# Altium schematic sheet PCB_Slave_Traffic_Light.SchDoc
size A3; SheetNumber: 3; SheetTotal: 3
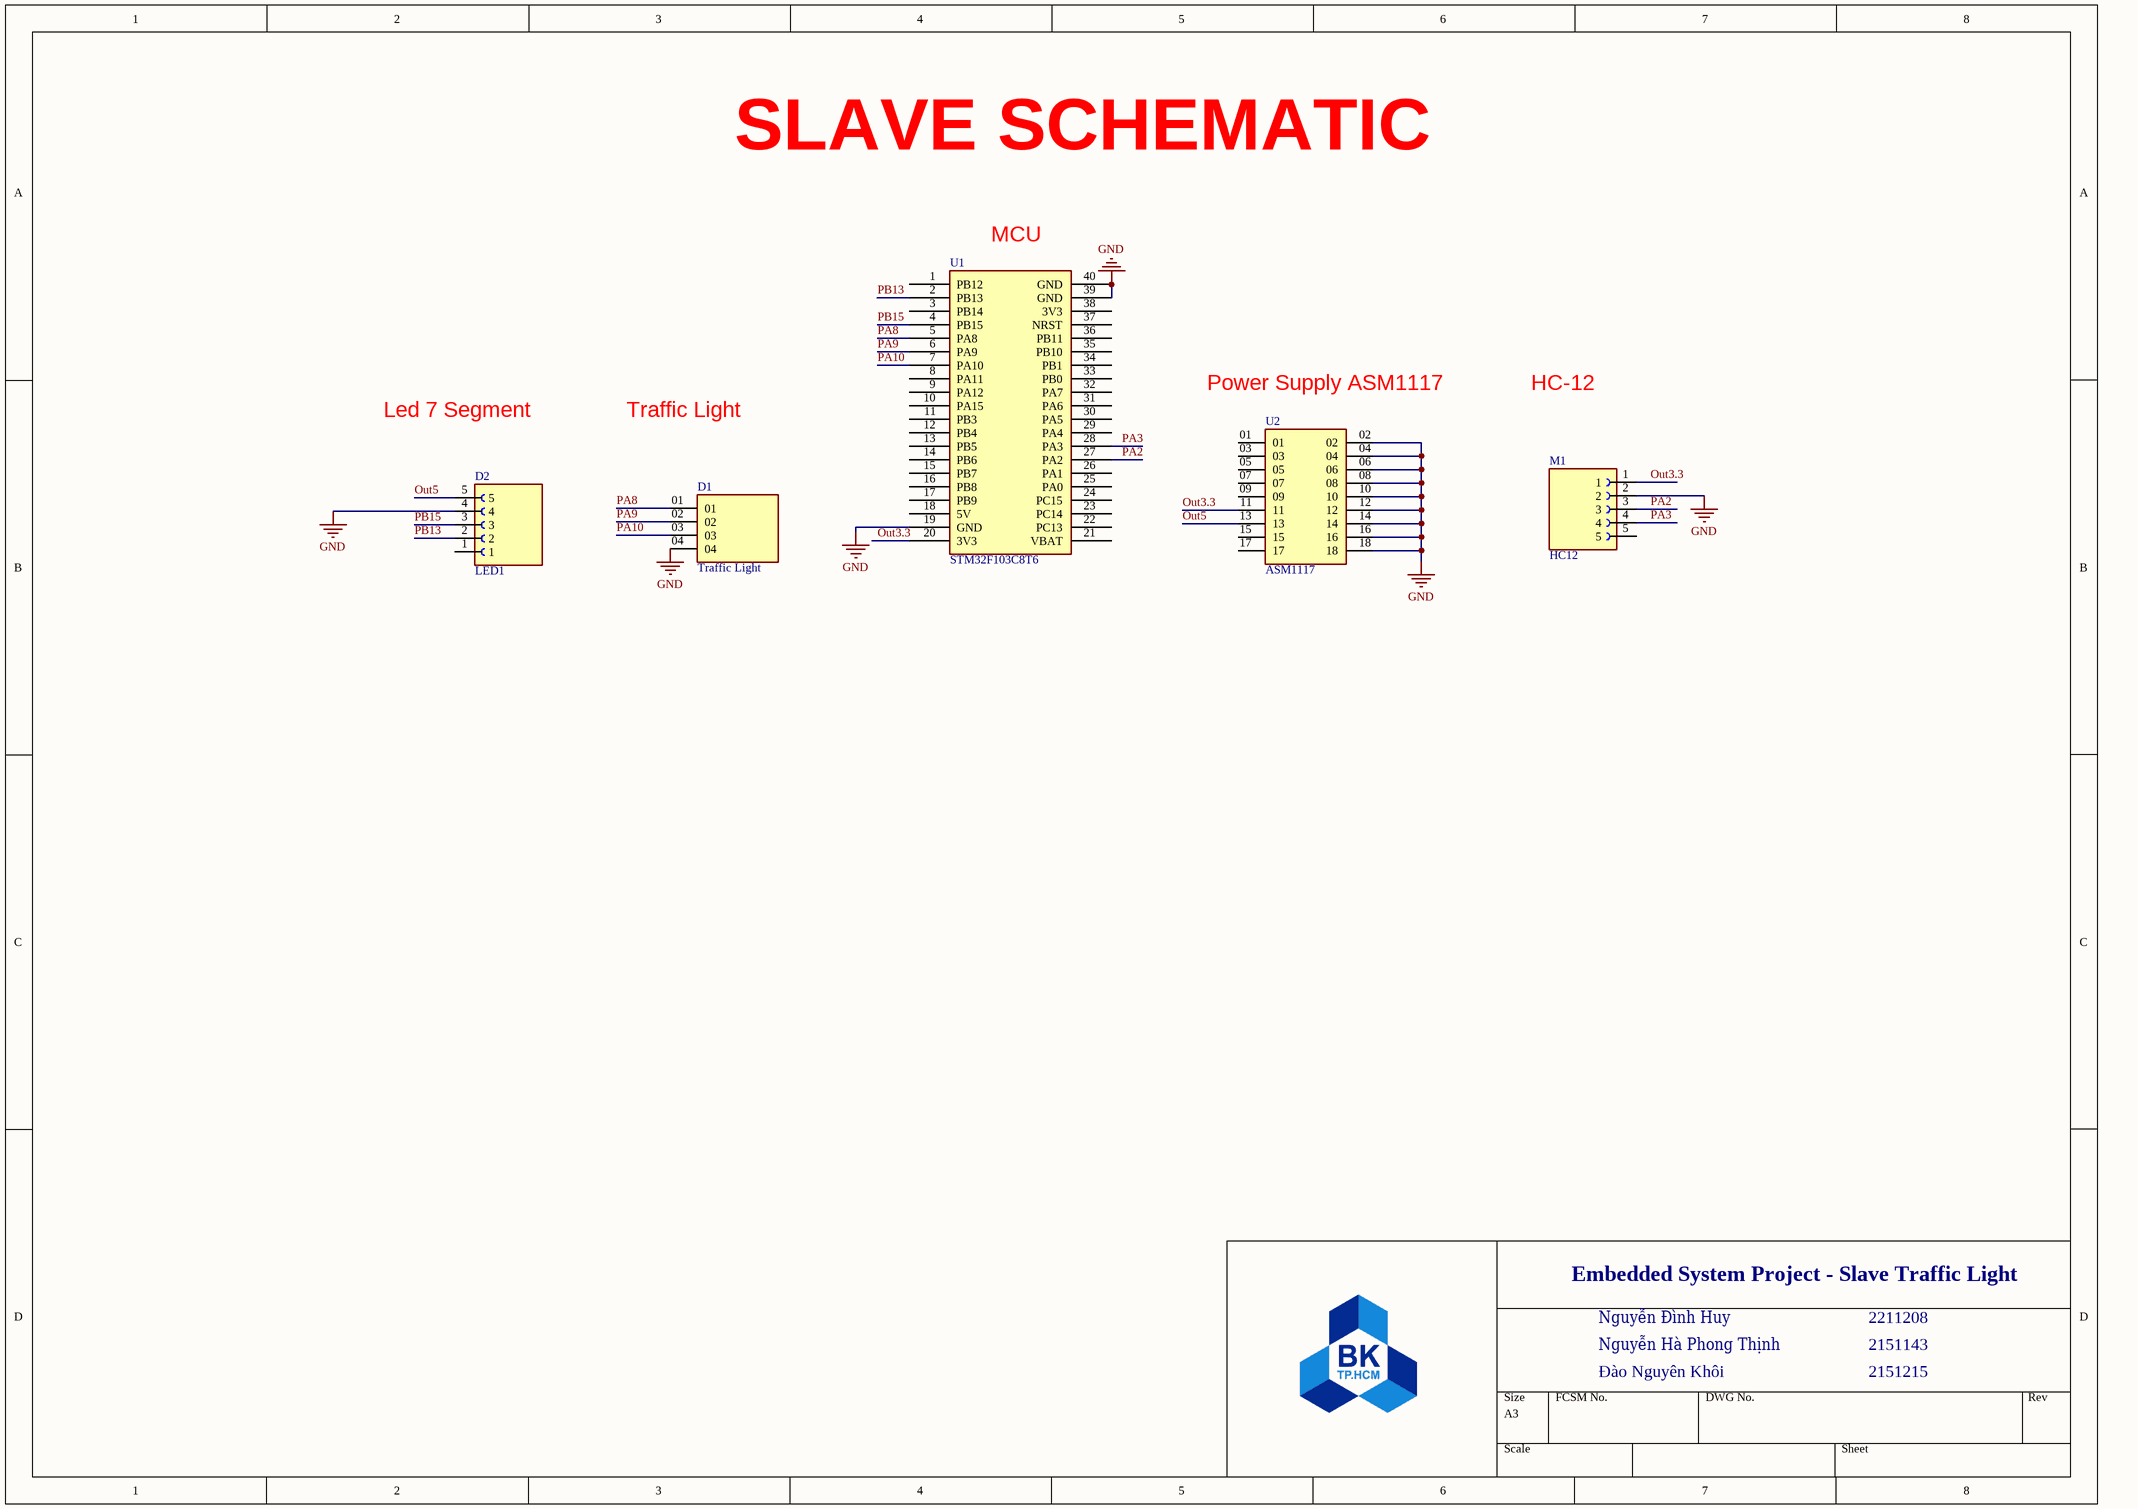
[diagram p0: PCB_Slave_Traffic_Light.SchDoc]

## Parts
D1  Traffic Light  [SAMTEC_HTSW-104-23-SM-S]
D2  LED1  [HARWIN_M20-7820546]
M1  HC12  [HARWIN_M20-7820546]
U1  STM32F103C8T6  [Stm32 BluePill]
U2  ASM1117  [SAMTEC_MTSW-109-13-G-D-905]

## Nets
GND: D1.04 D2.4 M1.2 U1.19(GND) U1.39(GND) U1.40(GND) U2.02 U2.04 U2.06 U2.08 U2.10 U2.12 U2.14 U2.16 U2.18
Out3.3: M1.1 U1.20(3V3) U2.11
Out5: D2.5 U2.13
PA2: M1.3 U1.27(PA2)
PA3: M1.4 U1.28(PA3)
PA8: D1.01 U1.5(PA8)
PA9: D1.02 U1.6(PA9)
PA10: D1.03 U1.7(PA10)
PB13: D2.2 U1.2(PB13)
PB15: D2.3 U1.4(PB15)

Not connected (* = marked no-connect by the designer): D2 1; M1 5; U1 1(PB12) 3(PB14) 8(PA11) 9(PA12) 10(PA15) 11(PB3) 12(PB4) 13(PB5) 14(PB6) 15(PB7) 16(PB8) 17(PB9) 18(5V) 21(VBAT) 22(PC13) 23(PC14) 24(PC15) 25(PA0) 26(PA1) 29(PA4) 30(PA5) 31(PA6) 32(PA7) 33(PB0) 34(PB1) 35(PB10) 36(PB11) 37(NRST) 38(3V3); U2 01 03 05 07 09 15 17

## Notes on the sheet
- SLAVE SCHEMATIC
- (near U1) MCU
- Led 7 Segment
- Traffic Light
- (near U2) Power Supply ASM1117
- HC-12
- Embedded System Project - Slave Traffic Light
- Nguyễn Đình Huy
- 2211208
- Nguyễn Hà Phong Thịnh
- Đào Nguyên Khôi
- 2151143
- 2151215

## Library data of the parts
D1 = HTSW-104-23-SM-S: HEADER, 4 CONTACTS, 1 ROW, THROUGH HOLE, 2.54 MM; Connector Systems:Board-to-Board; Pitch Spacing:2.54mm; No. of Rows:1Rows; No. of Contacts:4Contacts; Contact Termination Type:Through Hole; Product Range:HTSW Series; Gender:Header RoHS Compliant: Yes; MF: Samtec; MP: HTSW10423SMS; Package: None; Price: None; Check_prices: https://www.snapeda.com/parts/HTSW10423SMS/Samtec/view-part/?ref=eda; Value: *; SnapEDA_Link: https://www.snapeda.com/parts/HTSW10423SMS/Samtec/view-part/?ref=snap; Availability: In Stock; Purchase-URL: https://pricing.snapeda.com/search/part/HTSW10423SMS/?ref=eda
D2 M1 = M20-7820546: Package: None; Price: None; Value: *; MP: M20-7820546; Availability: Unavailable
U1 = BluePill: Designed By @Alixahedi
U2 = MTSW-109-13-G-D-905: Package: None; Price: None; Value: *; MP: MTSW-109-13-G-D-905; Availability: Unavailable